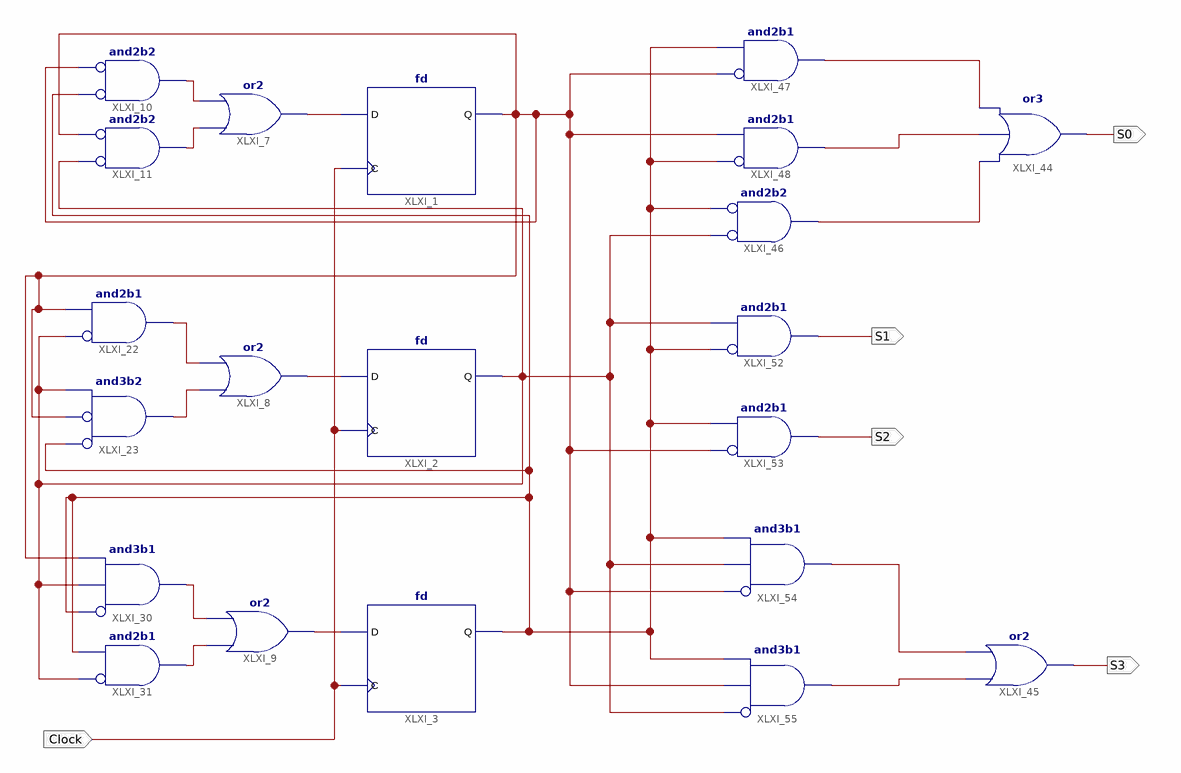
[diagram p0: schematic sheet 1]
// Xilinx ISE schematic Schematic_MqDeEstado.sch (spartan3) as structural Verilog: 21 symbols, 5 ports
module Schematic_MqDeEstado (
  input  Clock,
  output S2,
  output S1,
  output S0,
  output S3
);

  wire XLXN_1, XLXN_2, XLXN_3, XLXN_4, XLXN_5, XLXN_8, XLXN_9, XLXN_10, XLXN_11, XLXN_15, XLXN_16, XLXN_18,
       XLXN_40, XLXN_41, XLXN_42, XLXN_43, XLXN_44;

  fd XLXI_1 (.C(Clock), .D(XLXN_1), .Q(XLXN_8));
  fd XLXI_2 (.C(Clock), .D(XLXN_2), .Q(XLXN_9));
  fd XLXI_3 (.C(Clock), .D(XLXN_3), .Q(XLXN_18));
  or XLXI_7 (XLXN_1, XLXN_4, XLXN_5);
  or XLXI_8 (XLXN_2, XLXN_11, XLXN_10);
  or XLXI_9 (XLXN_3, XLXN_16, XLXN_15);
  and XLXI_11 (XLXN_4, ~XLXN_9, ~XLXN_8);  // and2b2
  and XLXI_10 (XLXN_5, ~XLXN_18, ~XLXN_8);  // and2b2
  and XLXI_22 (XLXN_10, ~XLXN_9, XLXN_8);  // and2b1
  and XLXI_23 (XLXN_11, ~XLXN_18, ~XLXN_8, XLXN_9);  // and3b2
  and XLXI_30 (XLXN_15, ~XLXN_18, XLXN_9, XLXN_8);  // and3b1
  and XLXI_31 (XLXN_16, ~XLXN_9, XLXN_18);  // and2b1
  or XLXI_44 (S0, XLXN_42, XLXN_41, XLXN_40);
  or XLXI_45 (S3, XLXN_44, XLXN_43);
  and XLXI_47 (XLXN_40, ~XLXN_8, XLXN_18);  // and2b1
  and XLXI_48 (XLXN_41, ~XLXN_18, XLXN_8);  // and2b1
  and XLXI_46 (XLXN_42, ~XLXN_9, ~XLXN_18);  // and2b2
  and XLXI_52 (S1, ~XLXN_18, XLXN_9);  // and2b1
  and XLXI_53 (S2, ~XLXN_8, XLXN_18);  // and2b1
  and XLXI_54 (XLXN_43, ~XLXN_8, XLXN_9, XLXN_18);  // and3b1
  and XLXI_55 (XLXN_44, ~XLXN_9, XLXN_8, XLXN_18);  // and3b1
endmodule
